# EAGLE schematic Battlebot_OSMC2 (EAGLE 5.06)
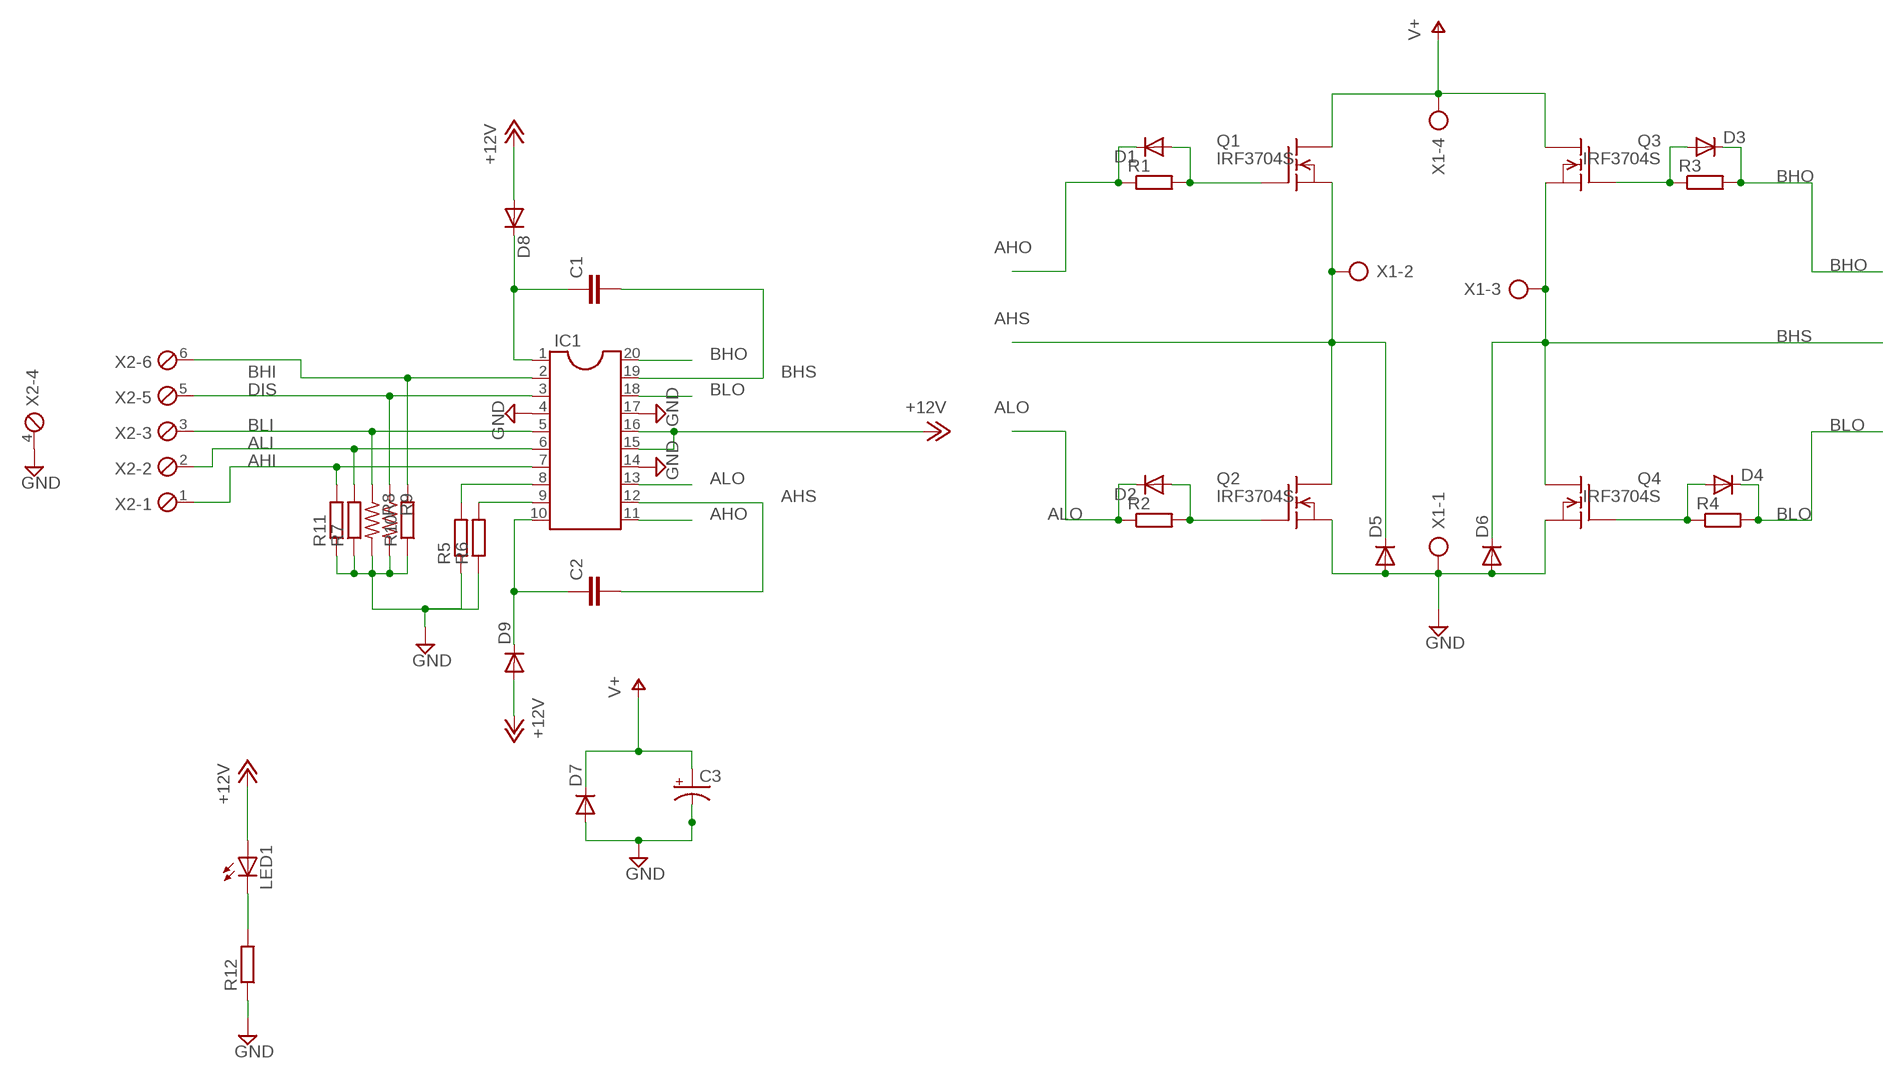
[diagram p0: schematic, sheet 1]

## Parts
C1  C7.5/3  [C7.5B3]
C2  C7.5/3  [C7.5B3]
C3  CPOL-USE5-13  [E5-13]
D1  DIODE-D-5  [D-5]
D2  DIODE-D-5  [D-5]
D3  DIODE-D-5  [D-5]
D4  DIODE-D-5  [D-5]
D5  DIODE-C1702-05  [C1702-05]
D6  DIODE-C1702-05  [C1702-05]
D7  DIODE-C1702-05  [C1702-05]
D8  1N4148DO35-7  [DO35-7]
D9  1N4148DO35-7  [DO35-7]
IC1  DIL20  [DIL20]
LED1  LED3MM  [LED3MM]
Q1  IRF3704S  BUZ325V  [TO218V]
Q2  IRF3704S  BUZ325V  [TO218V]
Q3  IRF3704S  BUZ325V  [TO218V]
Q4  IRF3704S  BUZ325V  [TO218V]
R1  R-EU_0204/5  [0204/5]
R2  R-EU_0204/5  [0204/5]
R3  R-EU_0204/5  [0204/5]
R4  R-EU_0204/5  [0204/5]
R5  R-EU_0204/5  [0204/5]
R6  R-EU_0204/5  [0204/5]
R7  R-EU_0204/5  [0204/5]
R8  R-US_0204/2V  [0204V]
R9  R-US_0204/2V  [0204V]
R10  R-EU_0204/5  [0204/5]
R11  R-EU_0204/5  [0204/5]
R12  R-EU_0204/5  [0204/5]
X1  AK500/4  [AK500/4]
X2  MPT6  [6POL254]

## Nets
+12V: D8.A D9.A IC1.15 IC1.16 LED1.A
AHI: IC1.7 R11.2 X2.1
AHO: D1.C IC1.11 R1.1
AHS: C2.2 D5.C IC1.12 Q1.3(S) Q2.2(D) X1.2
ALI: IC1.6 R7.2 X2.2
ALO: D2.C IC1.13 R2.1
BHI: IC1.2 R10.2 X2.6
BHO: D3.C IC1.20 R3.2
BHS: C1.2 D6.C IC1.19 Q3.3(S) Q4.2(D) X1.3
BLI: IC1.5 R8.1 X2.3
BLO: D4.C IC1.18 R4.2
DIS: IC1.3 R9.1 X2.5
GND: C3.- D5.A D6.A D7.A IC1.4 IC1.14 IC1.17 Q2.3(S) Q4.3(S) R5.1 R6.1 R7.1 R8.2 R9.2 R10.1 R11.1 R12.1 X1.1 X2.4
N$1: C2.1 D9.C IC1.10
N$2: C1.1 D8.C IC1.1
N$5: D1.A Q1.1(G) R1.2
N$6: D2.A Q2.1(G) R2.2
N$7: D4.A Q4.1(G) R4.1
N$8: D3.A Q3.1(G) R3.1
N$11: LED1.K(C) R12.2
N$14: IC1.8 R5.2
N$15: IC1.9 R6.2
V+: C3.+ D7.C Q1.2(D) Q3.2(D) X1.4

## Library data of the parts
C1 C2 = capacitor-wima:C: CAPACITOR naming: grid - package width
C3 = rcl:CPOL-US: POLARIZED CAPACITOR, American symbol
D1-D7 = diode:DIODE-: DIODE
D8 D9 = diode:1N4148: DIODE high speed (Philips)
IC1 = ic-package:DIL20: Dual In Line / Socket
LED1 = SparkFun:LED: LEDs Standard schematic elements and footprints for 5mm, 3mm, 1206, and 0603 sized LEDs. 5mm - Spark Fun Electronics SKU : COM-00529 (and others)
Q1-Q4 = transistor-fet:BUZ325: N-Channel Enhancement MOSFET 400V; 10,5A; 0,5Ohm
R1-R7 R10-R12 = rcl:R-EU_: RESISTOR, European symbol
R8 R9 = rcl:R-US_: RESISTOR, American symbol
X1 = con-ptr500:AK500/4: CONNECTOR
X2 = con-phoenix-254:MPT6: PHOENIX CONNECTOR